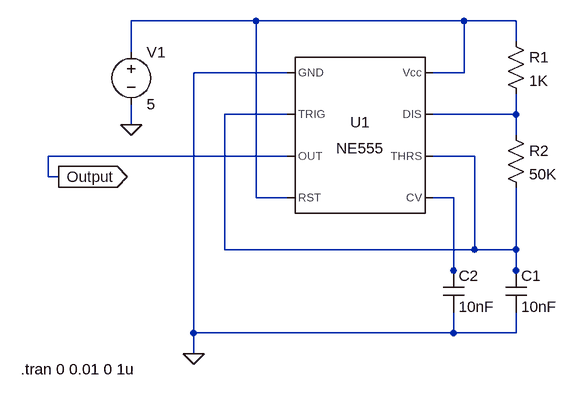
[diagram p0: schematic 3 LM555 Timer.asc]
3 LM555 Timer.asc, the LTspice schematic file:
Version 4
SHEET 1 880 680
WIRE 48 0 -144 0
WIRE 368 0 48 0
WIRE 448 0 368 0
WIRE 448 32 448 0
WIRE -144 48 -144 0
WIRE 96 80 -48 80
WIRE 368 80 368 0
WIRE 368 80 320 80
WIRE 96 144 0 144
WIRE 448 144 448 112
WIRE 448 144 320 144
WIRE -144 160 -144 128
WIRE 448 176 448 144
WIRE 96 208 -272 208
WIRE 384 208 320 208
WIRE -272 240 -272 208
WIRE -256 240 -272 240
WIRE 48 272 48 0
WIRE 96 272 48 272
WIRE 352 272 320 272
WIRE 0 352 0 144
WIRE 384 352 384 208
WIRE 384 352 0 352
WIRE 448 352 448 256
WIRE 448 352 384 352
WIRE 352 384 352 272
WIRE 448 384 448 352
WIRE 352 400 352 384
WIRE 448 400 448 384
WIRE -48 480 -48 80
WIRE 352 480 352 448
WIRE 352 480 -48 480
WIRE 448 480 448 448
WIRE 448 480 352 480
WIRE -48 512 -48 480
FLAG -48 512 0
FLAG -144 160 0
FLAG -256 240 Output
IOPIN -256 240 Out
SYMBOL Misc\\NE555 208 176 R0
SYMATTR InstName U1
SYMBOL voltage -144 32 R0
SYMATTR InstName V1
SYMATTR Value 5
SYMBOL res 432 16 R0
SYMATTR InstName R1
SYMATTR Value 1K
SYMBOL res 432 160 R0
SYMATTR InstName R2
SYMATTR Value 50K
SYMBOL cap 432 384 R0
SYMATTR InstName C1
SYMATTR Value 10nF
SYMBOL cap 336 384 R0
SYMATTR InstName C2
SYMATTR Value 10nF
TEXT -314 536 Left 2 !.tran 0 0.01 0 1u

The netlist it stands for:
* 3 LM555 Timer.asc
XU1 0 N002 Output N001 N004 N002 N003 N001 NE555  ; pins GND TRIG OUT RST CV THRS DIS Vcc
V1 N001 0 5
R1 N001 N003 1K
R2 N003 N002 50K
C1 N002 0 10nF
C2 N004 0 10nF
.tran 0 0.01 0 1u
.lib NE555.sub
.backanno
.end